# Altium schematic sheet 04-3 m8 io 2.SchDoc
size A3; SheetNumber: 7; SheetTotal: 16
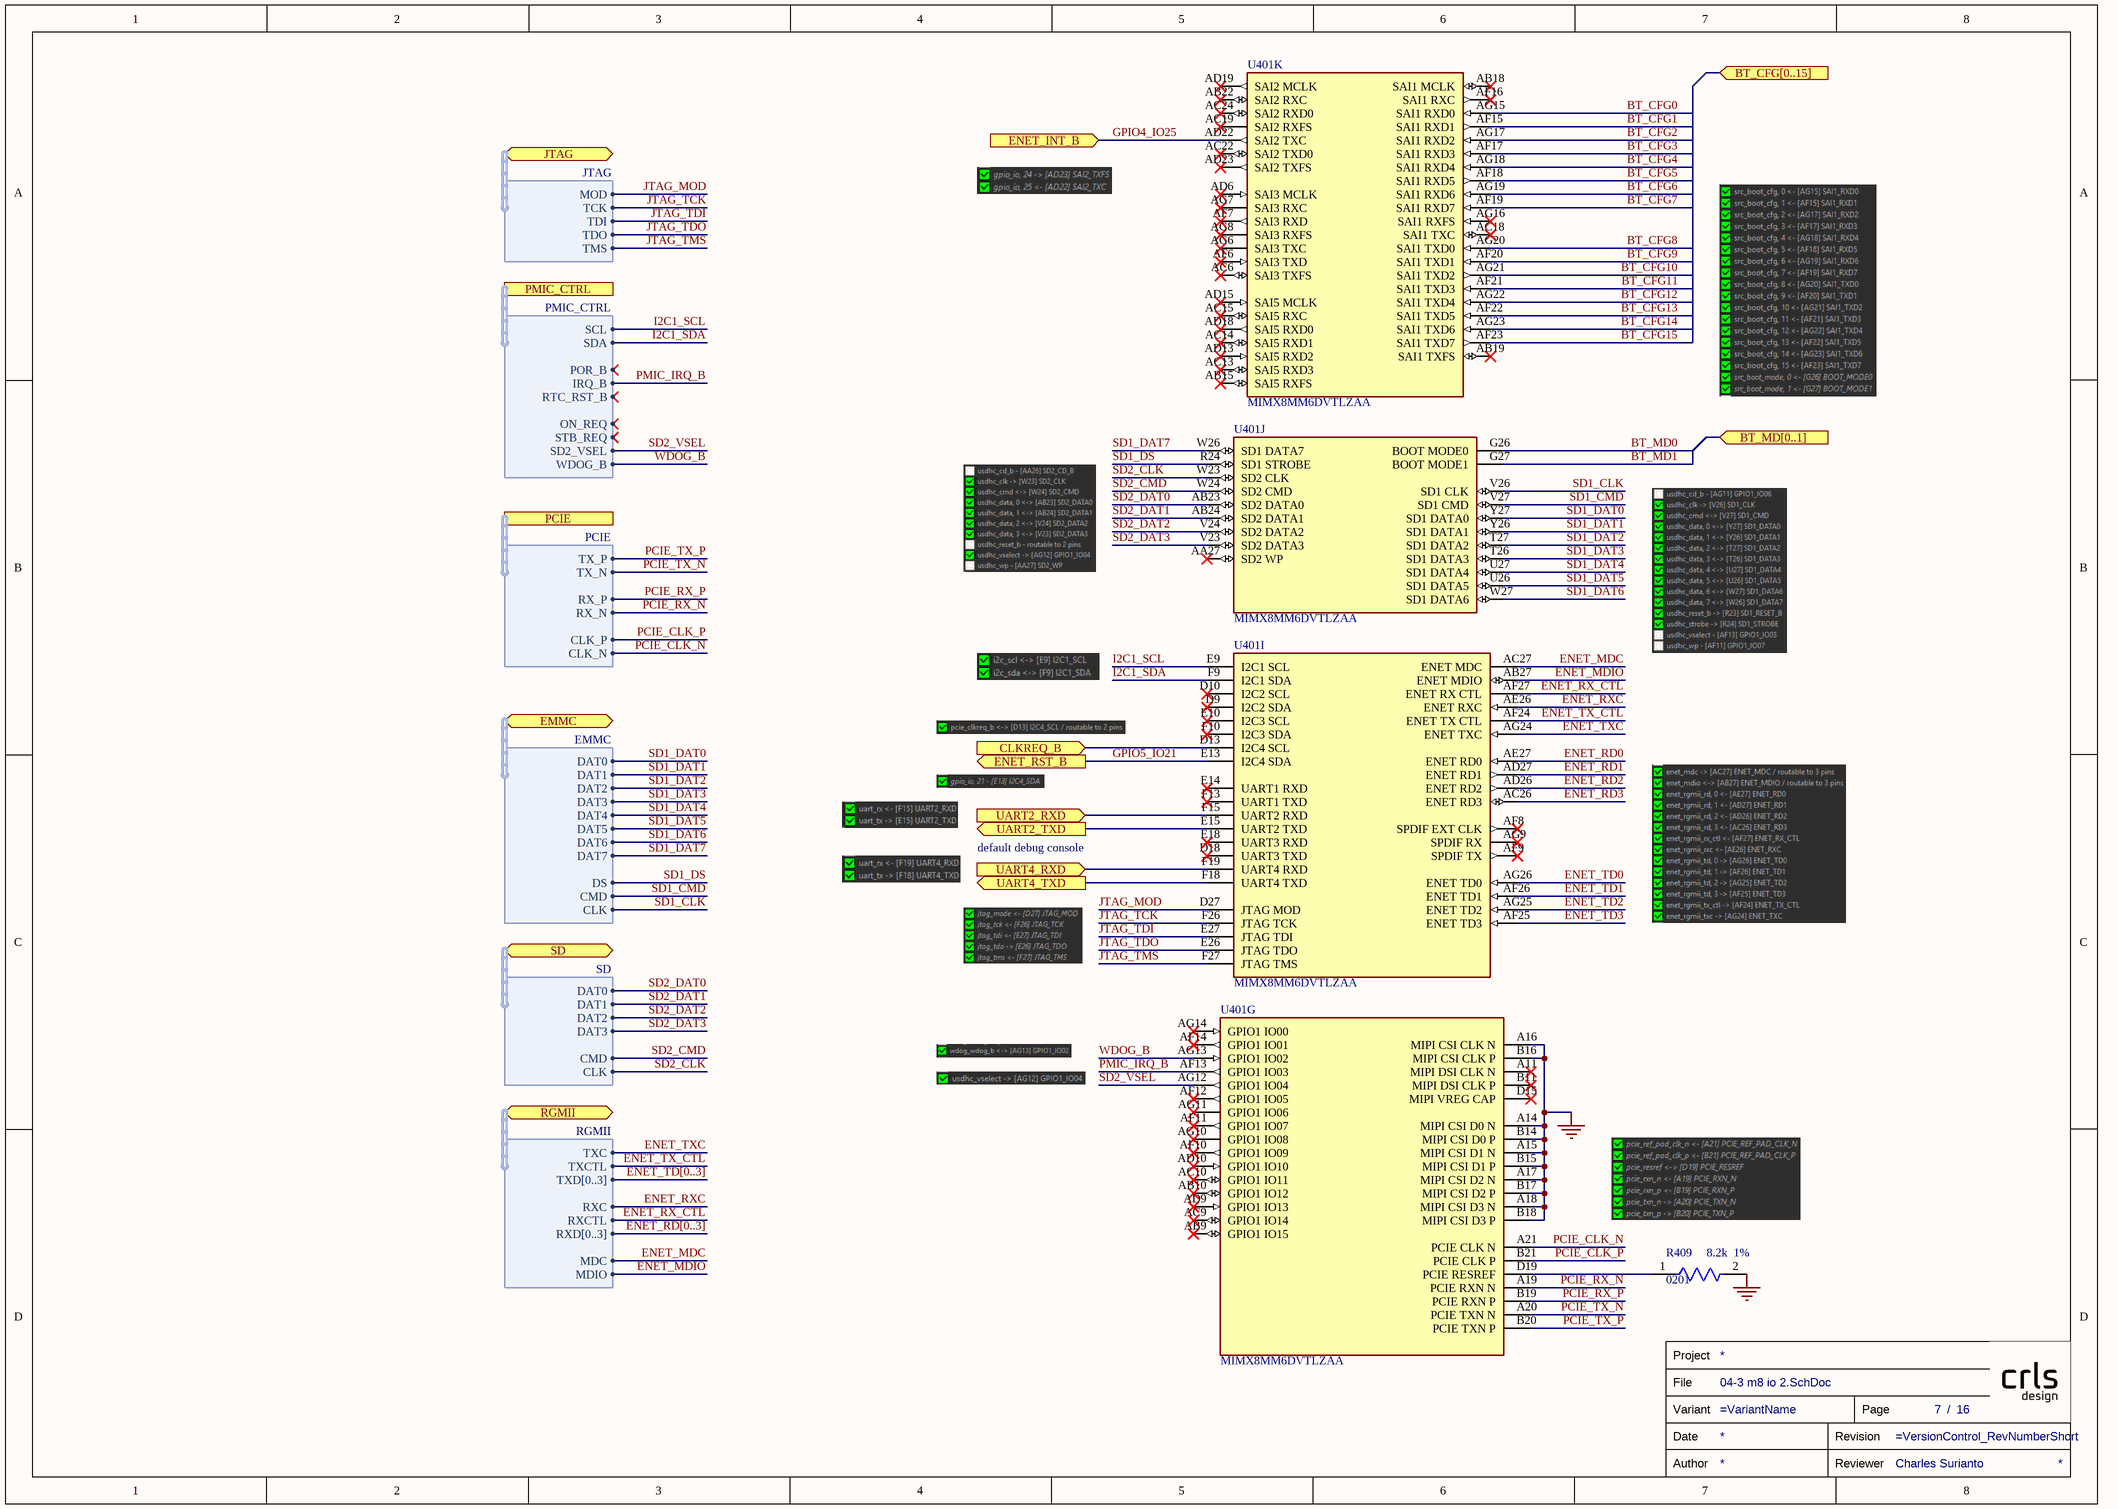
[diagram p0: 04-3 m8 io 2.SchDoc]

## Parts
R409  Resistance: 8.2k  Tolerance: 1%  Case/Package: 0201  [FP-AF0201-MFG]  (hidden comment: AF0201FR-078K2L)
TB?  Reviewer: Charles Surianto  (hidden comment: TITLE_BLOCK)  (graphical)
U401  MIMX8MM6DVTLZAA  [FP-SOT1967-2-IPC_A]  (parts G,I,J,K of 11)

## Ports
BT_CFG[0..15] (in), BT_MD[0..1] (in), CLKREQ_B (in), EMMC (bidir, harness EMMC), ENET_INT_B (in), ENET_RST_B (out), JTAG (bidir, harness JTAG), PCIE (harness PCIE), PMIC_CTRL (harness PMIC_CTRL), RGMII (bidir, harness RGMII), SD (bidir, harness SD), UART2_RXD (in), UART2_TXD (out), UART4_RXD (in), UART4_TXD (out)

## Harnesses
PCIE: TX_P, TX_N, RX_P, RX_N, CLK_P, CLK_N
PMIC_CTRL: SCL, SDA, IRQ_B, POR_B, RTC_RST_B, ON_REQ, STB_REQ, SD2_VSEL, WDOG_B
SD: DAT3, DAT0, DAT1, DAT2, CMD, CLK
EMMC: DAT1, DAT3, DAT2, DAT4, DAT0, DAT5, DAT6, DAT7, DS, CMD, CLK
RGMII: TXC, TXCTL, TXD[0..3], RXC, RXCTL, RXD[0..3], MDIO, MDC
JTAG: MOD, TCK, TDI, TDO, TMS

## Nets
GND: R409.2 U401.A14(MIPI_CSI_D0_N) U401.A15(MIPI_CSI_D1_N) U401.A16(MIPI_CSI_CLK_N) U401.A17(MIPI_CSI_D2_N) U401.A18(MIPI_CSI_D3_N) U401.B14(MIPI_CSI_D0_P) U401.B15(MIPI_CSI_D1_P) U401.B16(MIPI_CSI_CLK_P) U401.B17(MIPI_CSI_D2_P) U401.B18(MIPI_CSI_D3_P)
BT_CFG0: U401.AG15(SAI1_RXD0)
BT_CFG1: U401.AF15(SAI1_RXD1)
BT_CFG2: U401.AG17(SAI1_RXD2)
BT_CFG3: U401.AF17(SAI1_RXD3)
BT_CFG4: U401.AG18(SAI1_RXD4)
BT_CFG5: U401.AF18(SAI1_RXD5)
BT_CFG6: U401.AG19(SAI1_RXD6)
BT_CFG7: U401.AF19(SAI1_RXD7)
BT_CFG8: U401.AG20(SAI1_TXD0)
BT_CFG9: U401.AF20(SAI1_TXD1)
BT_CFG10: U401.AG21(SAI1_TXD2)
BT_CFG11: U401.AF21(SAI1_TXD3)
BT_CFG12: U401.AG22(SAI1_TXD4)
BT_CFG13: U401.AF22(SAI1_TXD5)
BT_CFG14: U401.AG23(SAI1_TXD6)
BT_CFG15: U401.AF23(SAI1_TXD7)
BT_MD0: U401.G26(BOOT_MODE0)
BT_MD1: U401.G27(BOOT_MODE1)
CLKREQ_B: U401.D13(I2C4_SCL) ; port CLKREQ_B
ENET_MDC: U401.AC27(ENET_MDC) ; port RGMII.MDC
ENET_MDIO: U401.AB27(ENET_MDIO) ; port RGMII.MDIO
ENET_RD0: U401.AE27(ENET_RD0)
ENET_RD1: U401.AD27(ENET_RD1)
ENET_RD2: U401.AD26(ENET_RD2)
ENET_RD3: U401.AC26(ENET_RD3)
ENET_RX_CTL: U401.AF27(ENET_RX_CTL) ; port RGMII.RXCTL
ENET_RXC: U401.AE26(ENET_RXC) ; port RGMII.RXC
ENET_TD0: U401.AG26(ENET_TD0)
ENET_TD1: U401.AF26(ENET_TD1)
ENET_TD2: U401.AG25(ENET_TD2)
ENET_TD3: U401.AF25(ENET_TD3)
ENET_TX_CTL: U401.AF24(ENET_TX_CTL) ; port RGMII.TXCTL
ENET_TXC: U401.AG24(ENET_TXC) ; port RGMII.TXC
GPIO4_IO25: U401.AD22(SAI2_TXC) ; port ENET_INT_B
GPIO5_IO21: U401.E13(I2C4_SDA) ; port ENET_RST_B
I2C1_SCL: U401.E9(I2C1_SCL) ; port PMIC_CTRL.SCL
I2C1_SDA: U401.F9(I2C1_SDA) ; port PMIC_CTRL.SDA
JTAG_MOD: U401.D27(JTAG_MOD) ; port JTAG.MOD
JTAG_TCK: U401.F26(JTAG_TCK) ; port JTAG.TCK
JTAG_TDI: U401.E27(JTAG_TDI) ; port JTAG.TDI
JTAG_TDO: U401.E26(JTAG_TDO) ; port JTAG.TDO
JTAG_TMS: U401.F27(JTAG_TMS) ; port JTAG.TMS
PCIE_CLK_N: U401.A21(PCIE_CLK_N) ; port PCIE.CLK_N
PCIE_CLK_P: U401.B21(PCIE_CLK_P) ; port PCIE.CLK_P
PCIE_RX_N: U401.A19(PCIE_RXN_N) ; port PCIE.RX_N
PCIE_RX_P: U401.B19(PCIE_RXN_P) ; port PCIE.RX_P
PCIE_TX_N: U401.A20(PCIE_TXN_N) ; port PCIE.TX_N
PCIE_TX_P: U401.B20(PCIE_TXN_P) ; port PCIE.TX_P
PMIC_IRQ_B: U401.AF13(GPIO1_IO03) ; port PMIC_CTRL.IRQ_B
SD1_CLK: U401.V26(SD1_CLK) ; port EMMC.CLK
SD1_CMD: U401.V27(SD1_CMD) ; port EMMC.CMD
SD1_DAT0: U401.Y27(SD1_DATA0) ; port EMMC.DAT0
SD1_DAT1: U401.Y26(SD1_DATA1) ; port EMMC.DAT1
SD1_DAT2: U401.T27(SD1_DATA2) ; port EMMC.DAT2
SD1_DAT3: U401.T26(SD1_DATA3) ; port EMMC.DAT3
SD1_DAT4: U401.U27(SD1_DATA4) ; port EMMC.DAT4
SD1_DAT5: U401.U26(SD1_DATA5) ; port EMMC.DAT5
SD1_DAT6: U401.W27(SD1_DATA6) ; port EMMC.DAT6
SD1_DAT7: U401.W26(SD1_DATA7) ; port EMMC.DAT7
SD1_DS: U401.R24(SD1_STROBE) ; port EMMC.DS
SD2_CLK: U401.W23(SD2_CLK) ; port SD.CLK
SD2_CMD: U401.W24(SD2_CMD) ; port SD.CMD
SD2_DAT0: U401.AB23(SD2_DATA0) ; port SD.DAT0
SD2_DAT1: U401.AB24(SD2_DATA1) ; port SD.DAT1
SD2_DAT2: U401.V24(SD2_DATA2) ; port SD.DAT2
SD2_DAT3: U401.V23(SD2_DATA3) ; port SD.DAT3
SD2_VSEL: U401.AG12(GPIO1_IO04) ; port PMIC_CTRL.SD2_VSEL
UART2_RXD: U401.F15(UART2_RXD) ; port UART2_RXD
UART2_TXD: U401.E15(UART2_TXD) ; port UART2_TXD
UART4_RXD: U401.F19(UART4_RXD) ; port UART4_RXD
UART4_TXD: U401.F18(UART4_TXD) ; port UART4_TXD
WDOG_B: U401.AG13(GPIO1_IO02) ; port PMIC_CTRL.WDOG_B
NetR409_1: R409.1 U401.D19(PCIE_RESREF)

Not connected (* = marked no-connect by the designer): U401 A11(MIPI_DSI_CLK_N)* AA27(SD2_WP)* AB9(GPIO1_IO15)* AB10(GPIO1_IO12)* AB15(SAI5_RXFS)* AB18(SAI1_MCLK)* AB19(SAI1_TXFS)* AB22(SAI2_RXC)* AC6(SAI3_TXFS)* AC9(GPIO1_IO14)* AC10(GPIO1_IO11)* AC13(SAI5_RXD3)* AC14(SAI5_RXD1)* AC15(SAI5_RXC)* AC18(SAI1_TXC)* AC19(SAI2_RXFS)* AC22(SAI2_TXD0)* AC24(SAI2_RXD0)* AD6(SAI3_MCLK)* AD9(GPIO1_IO13)* AD10(GPIO1_IO10)* AD13(SAI5_RXD2)* AD15(SAI5_MCLK)* AD18(SAI5_RXD0)* AD19(SAI2_MCLK)* AD23(SAI2_TXFS)* AF6(SAI3_TXD)* AF7(SAI3_RXD)* AF8(SPDIF_EXT_CLK)* AF9(SPDIF_TX)* AF10(GPIO1_IO09)* AF11(GPIO1_IO07)* AF12(GPIO1_IO05)* AF14(GPIO1_IO01)* AF16(SAI1_RXC)* AG6(SAI3_TXC)* AG7(SAI3_RXC)* AG8(SAI3_RXFS)* AG9(SPDIF_RX)* AG10(GPIO1_IO08)* AG11(GPIO1_IO06)* AG14(GPIO1_IO00)* AG16(SAI1_RXFS)* B11(MIPI_DSI_CLK_P)* D9(I2C2_SDA)* D10(I2C2_SCL)* D15(MIPI_VREG_CAP)* D18(UART3_TXD)* E10(I2C3_SCL)* E14(UART1_RXD)* E18(UART3_RXD)* F10(I2C3_SDA)* F13(UART1_TXD)*

## Buses and harness runs
bus ENET_RD[0..3]
bus ENET_TD[0..3]

## Notes on the sheet
- default debug console
- (in symbol TITLE_BLOCK) Project; File; Variant; Page; /; Date; Revision; Author; Reviewer

## Library data of the parts
R409 = CMP-03412-049761-1: Anti-Sulfurated Chip Resistors Automotive Grade 8.2kΩ 1% 200ppm/°C 0201; Max Power Dissipation: 50mW; Width: 0.012inch; Min Operating Temperature: -55°C; Number of Terminations: 2; Packaging: Tape and Reel; Resistor Type: Thick Film; Height: 0.01inch; RoHS Compliant: Yes; Series: AF; Length: 0.024inch; Max Operating Temperature: 125°C; Temperature Coefficient: 200ppm/°C; Features: Moisture Resistant
U401 = CMP-10096-000012-1: IC MPU I.MX 8M MINI QUAD BGA; RoHS Compliant: Yes
TB? = TITLE_BLOCK: Review Date: *